# Altium schematic sheet MCU152A_Connectors.SchDoc
size 431 x 279 mm; Date: Not shown in title block; ApprovedBy: Not shown in title block; CheckedBy: Not shown in title block; Author: Not shown in title block; CompanyName: Not shown in title block; Engineer: Not shown in title block; Organization: Not shown in title block; Address1: Not shown in title block; Address2: Not shown in title block; Address3: Not shown in title block; Address4: Not shown in title block; DocumentNumber: 2; Revision: Use project parameter SCH_Rev; SheetNumber: 2; SheetTotal: 8; PageSetup: Record=PageOptions|CenterHorizontal=True|CenterVertical=True|PrintScale=1.00|XCorrection=1.00|YCorrection=1.00|PrintKind=0|BorderSize=5000000|LeftOffset=0|BottomOffset=0|Orientation=2|PaperLength=1000|PaperWidth=1000|Scale=100|PaperSource=15|PrintQuality=600|MediaType=1|DitherType=10|PaperKind=Letter|PrintScaleMode=1; CurrentTime: Not shown in title block; CurrentDate: Not shown in title block; Time: Not shown in title block; DocumentFullPathAndName: Not shown in title block; DocumentName: Not shown in title block; ModifiedDate: Not shown in title block; ImagePath: Not shown in title block
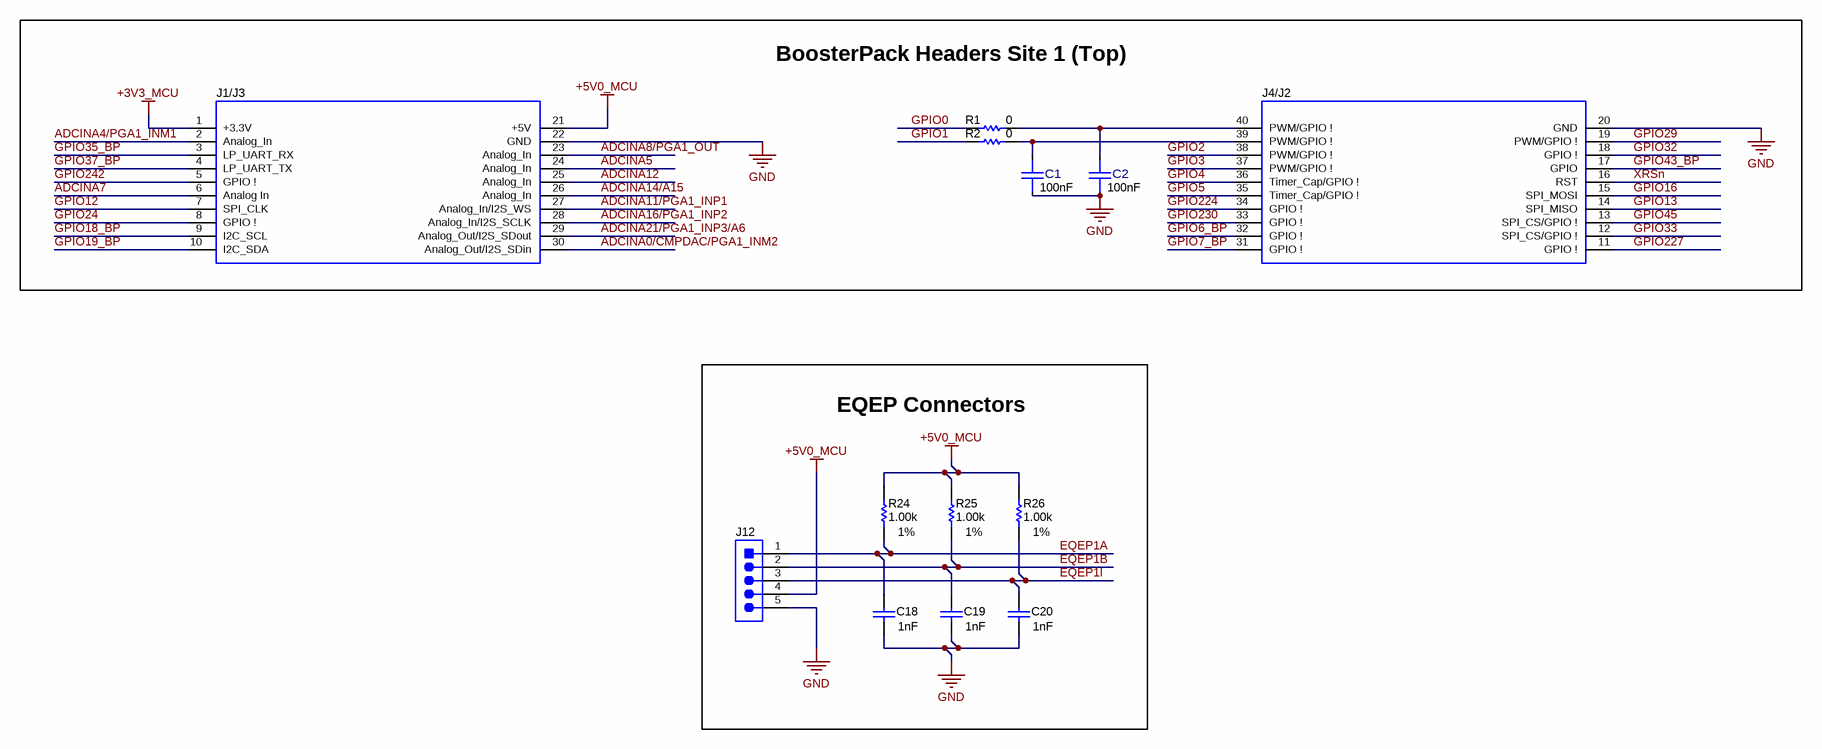
[diagram p0: MCU152A_Connectors.SchDoc]

## Parts
C1  Cap_F: 100nF  [FP-885012205018_0402-MFG]  (hidden comment: 885012205018)
C2  Cap_F: 100nF  [FP-885012205018_0402-MFG]  (hidden comment: 885012205018)
C18  Cap_F: 1nF  [0402]  (hidden comment: 885012205061)
C19  Cap_F: 1nF  [0402]  (hidden comment: 885012205061)
C20  Cap_F: 1nF  [0402]  (hidden comment: 885012205061)
J1/J3  SSQ-110-03-T-D  [BoosterPack_40pin_J1J3]  (value not drawn)
J4/J2  SSQ-110-03-T-D  [BoosterPack_40pin_J2J4]  (value not drawn)
J12  61300511121  [Wurth_61300511121]  (value not drawn)
R1  ValueDisplayed: 0  [0402]  (hidden comment: RC0402JR-070RL)
R2  ValueDisplayed: 0  [0402]  (hidden comment: RC0402JR-070RL)
R24  ValueDisplayed: 1.00k  Value1: 1%  [0402]  (hidden comment: CRCW04021K00FKED)
R25  ValueDisplayed: 1.00k  Value1: 1%  [0402]  (hidden comment: CRCW04021K00FKED)
R26  ValueDisplayed: 1.00k  Value1: 1%  [0402]  (hidden comment: CRCW04021K00FKED)

## Blocks framed on the sheet
BoosterPack Headers Site 1 (Top): C1 C2 J1/J3 J4/J2 R1 R2
EQEP Connectors: C18-C20 J12 R24-R26

## Nets
+3V3_MCU: J1/J3.1(+3.3V)
+5V0_MCU: J1/J3.21(+5V) J12.4 R24.2 R25.2 R26.2
GND: C1.1 C2.1 C18.2 C19.2 C20.2 J1/J3.22(GND) J4/J2.20(GND) J12.5
ADCINA0/CMPDAC/PGA1_INM2: J1/J3.30(Analog_Out/I2S_SDin)
ADCINA4/PGA1_INM1: J1/J3.2(Analog_In)
ADCINA5: J1/J3.24(Analog_In)
ADCINA7: J1/J3.6(Analog_In)
ADCINA8/PGA1_OUT: J1/J3.23(Analog_In)
ADCINA11/PGA1_INP1: J1/J3.27(Analog_In/I2S_WS)
ADCINA12: J1/J3.25(Analog_In)
ADCINA14/A15: J1/J3.26(Analog_In)
ADCINA16/PGA1_INP2: J1/J3.28(Analog_In/I2S_SCLK)
ADCINA21/PGA1_INP3/A6: J1/J3.29(Analog_Out/I2S_SDout)
EQEP1A: C18.1 J12.1 R24.1
EQEP1B: C19.1 J12.2 R25.1
EQEP1I: C20.1 J12.3 R26.1
GPIO0: R1.1
GPIO1: R2.1
GPIO2: J4/J2.38(PWM/GPIO_!)
GPIO3: J4/J2.37(PWM/GPIO_!)
GPIO4: J4/J2.36(Timer_Cap/GPIO_!)
GPIO5: J4/J2.35(Timer_Cap/GPIO_!)
GPIO6_BP: J4/J2.32(GPIO_!)
GPIO7_BP: J4/J2.31(GPIO_!)
GPIO12: J1/J3.7(SPI_CLK)
GPIO13: J4/J2.14(SPI_MISO)
GPIO16: J4/J2.15(SPI_MOSI)
GPIO18_BP: J1/J3.9(I2C_SCL)
GPIO19_BP: J1/J3.10(I2C_SDA)
GPIO24: J1/J3.8(GPIO_!)
GPIO29: J4/J2.19(PWM/GPIO_!)
GPIO32: J4/J2.18(GPIO_!)
GPIO33: J4/J2.12(SPI_CS/GPIO_!)
GPIO35_BP: J1/J3.3(LP_UART_RX)
GPIO37_BP: J1/J3.4(LP_UART_TX)
GPIO43_BP: J4/J2.17(GPIO)
GPIO45: J4/J2.13(SPI_CS/GPIO_!)
GPIO224: J4/J2.34(GPIO_!)
GPIO227: J4/J2.11(GPIO_!)
GPIO230: J4/J2.33(GPIO_!)
GPIO242: J1/J3.5(GPIO_!)
XRSn: J4/J2.16(RST)
NetC1_2: C1.2 J4/J2.39(PWM/GPIO_!) R2.2
NetC2_2: C2.2 J4/J2.40(PWM/GPIO_!) R1.2

## Notes on the sheet
- Drawn By:
- SVN Rev:
- Number:
- TID #:
- Orderable:
- Rev:
- Sheet Title:
- File:
- Project Title:
- Designed for:
- Assembly Variant:
- Mod. Date:
- Sheet:
- Size:
- of
- B
- http://www.ti.com
- Texas Instruments and/or its licensors do not warrant the accuracy or completeness of this specification or any information contained therein. Texas Instruments and/or its licensors do not warrant that this design will meet the specifications, will be suitable for your application or fit for any particular purpose, or will operate in an implementation. Texas Instruments and/or its licensors do not warrant that the design is production worthy. You should completely validate and test your design implementation to confirm the system functionality for your application.
- Engineer:
- Contact:
- © Texas Instruments

## Library data of the parts
C1 C2 = CMP-0090362-1: 0.1µF ±10% 10V Ceramic Capacitor X7R 0402 (1005 Metric); Manufacturer: Wurth Electronics; AEC Qualified: No; Value: 100nF; SizeZ_mm: 0.55mm; ValueDisplayed: 100000pF; TempCo: 15%; RoHS: TRUE; Tolerance_%: 10%; datasheet: https://www.we-online.com/catalog/datasheet/885012205018.pdf; Lead Free: Yes; Operating Temperature Range: -55°C to +125°C; ComponentLink1Description: Datasheet; Digikey Description: CAP CER 0.1UF 10V X7R 0402; Supplier Part Number 1: 732-7513-1-ND; Supplier 2: Mouser; Mouser Part Number: 710-885012205018; Digikey Part Number: 732-7513-1-ND; Temperature Characteristic: X7R; Supplier 1: Digikey; Datasheet Path: datasheets/Cap-885012205018.pdf; ComponentLink1URL: https://www.we-online.com/catalog/datasheet/885012205018.pdf; VDC_V: 10V; Supplier Part Number 2: 710-885012205018; PackageReference: 0402; PartNumber: 885012205018; Part Number: 885012205018; helpURL: https://upverter.com/upn/revision/1acbe355db19639d/
C18-C20 = CMP-0006231-2: CAP, CERM, 1000 pF, 50 V, +/- 10%, X7R, 0402; Manufacturer: Wurth Elektronik; Polarized: N; Value: 1000pF; U/M: EA; Value1: Unknown; VDC_V: 50V; TaMin_C: -55°C; TaMax_C: 125°C; SizeArea_mm2: 0.5; SizeAreaWB_mm2: 3; SizeX_mm: 1; SizeZ_mm: 0.6; AEC Category: Q200; CompType: Capacitor; PartNumber: 885012205061; ValueDisplayed: 1000pF; PackageReference: 0402; RoHS: Y; Tolerance_%: 10%; Value2: 50V; MountType: SMT; Technology: Ceramic; TempCo: X7R; Cap_Case: 0402; SizeY_mm: 0.5; Published: 2008-06-19; Publisher: Texas Instruments; LatestRevisionDate: 2017-03-09; ComponentLink1Description: Datasheet link; ComponentLink1URL: http://katalog.we-online.de/pbs/datasheet/885012205061.pdf; Supplier 1: Digi-Key; Supplier Part Number 1: 732-7556-1-ND; Supplier 2: Mouser; Supplier Part Number 2: 710-885012205061; AEC Qualified: N; AEC Grade: N/A
J1/J3 = CMP-0003837-4: Receptacle, 2.54mm, 10x2, Tin, TH; Alternate PartNumber: CRD-081413-A-G; Manufacturer: Samtec; Alternate Manufacturer: Major League Electronics; Note: Booster Pack 40 pin J1 and J3; Green_Lifecycle: Active; Green_REACh: Incomplete; Supplier 1: Digi-Key; CompType: Receptacle; PackageReference: 10x2 Receptacle; RoHS: Y; Supplier Part Number 1: SAM1204-10-ND; MountType: TH; PartNumber: SSQ-110-03-T-D; ComponentLink1Description: Datasheet Link; ComponentLink1URL: https://www.samtec.com/ftppub/cpdf/SSQ-1XX-XX-XXX-X-XX-XXX-XX-X-MKT.pdf; Supplier 2: Newark; Supplier Part Number 2: 11P8392; Green_EU RoHS: Passed; Green_EU RoHS-2: Passed
J4/J2 = CMP-0078266-4: Receptacle, 2.54mm, 10x2, Tin, TH; Alternate PartNumber: CRD-081413-A-G; Manufacturer: Samtec; Alternate Manufacturer: Major League Electronics; Note: Booster Pack 40 pin J2 and J4; Green_REACh: Incomplete; Green_Lifecycle: Active; Green_EU RoHS-2: Passed; CompType: Receptacle; Supplier 1: Digi-Key; PackageReference: 10x2 Receptacle; RoHS: Y; Supplier Part Number 1: SAM1204-10-ND; PartNumber: SSQ-110-03-T-D; MountType: TH; ComponentLink1Description: Datasheet Link; Green_EU RoHS: Passed; ComponentLink1URL: https://www.samtec.com/ftppub/cpdf/SSQ-1XX-XX-XXX-X-XX-XXX-XX-X-MKT.pdf; Supplier 2: Newark; Supplier Part Number 2: 11P8392
J12 = CMP-0084909-1: Header, 2.54mm, 5x1, Gold, TH; Manufacturer: Wurth Elektronik; Pitch_mm: 2.54; Gender: Male; Row_Count: 1; Shrouded: N; Current_A: 3A; Voltage_V: 250V; Color: Black; PinCount: 5; ContactFinish: Gold; ComponentLink1URL: https://katalog.we-online.de/em/datasheet/6130xx11121.pdf; ComponentLink1Description: Datasheet URL; CompType: Header; MountType: TH; PartNumber: 61300511121; RoHS: Y; PackageReference: Header, 2.54mm, 5x1, TH; ClassName: Header; Orientation: Vertical
R1 R2 = CMP-0027004-2: RES, 0, 5%, 0.063 W, 0402; Manufacturer: Yageo America; Power_W: 63mW; TempCo: 200 ppm/C; Value_Code: 0000; U/M: EA; Value: 0; EIA_Code: E24; SizeX_mm: 1; SizeY_mm: 0.5; SizeZ_mm: 0.6; Value2: 0.063W; VDC_V: 50V; AEC Category: Q200; Supplier Part Number 2: 603-RC0402JR-070RL; Publisher: Texas Instruments; Supplier 2: Mouser; Supplier Part Number 3: 9232516; Supplier 3: Farnell; Published: 2008-06-26; RoHS: Y; Value1: 5%; MountType: SMT; Supplier 1: Digi-Key; PackageReference: 0402; Tolerance_%: 5%; Res_ohm: 0; SizeArea_mm2: 0.5; CompType: Resistor; LatestRevisionDate: 2017-03-09; PartNumber: RC0402JR-070RL; AEC Qualified: ?; ComponentLink1Description: Datasheet link; Supplier Part Number 1: 311-0.0JRCT-ND; Technology: Thick Film; ComponentLink1URL: http://www.yageo.com/pdf/Pu-RC0402_51_PbFree_L_2.pdf
R24-R26 = CMP-0026071-3: RES, 1.00 k, 1%, 0.063 W, AEC-Q200 Grade 0, 0402; Manufacturer: Vishay-Dale; Value: 1.00k; Res_ohm: 1k; Value_Code: 1k00; Power_W: 63mW; Value2: 0.063W; VDC_V: 50V; TempCo: 100 ppm/C; SizeArea_mm2: 0.5; SizeX_mm: 1; SizeZ_mm: 0.6; EIA_Code: E96; AEC Category: Q200; AEC Qualified: Y; AEC Grade: 0; CompType: Resistor; PartNumber: CRCW04021K00FKED; PackageReference: 0402; RoHS: E; Tolerance_%: 1%; MountType: SMT; Technology: Thick Film; SizeY_mm: 0.5; ComponentLink1Description: Datasheet link; ComponentLink1URL: http://www.vishay.com/docs/20035/dcrcwe3.pdf; Supplier 1: Digi-Key; Supplier Part Number 1: 541-1.00KLCT-ND; Supplier 2: Newark; Supplier Part Number 2: 52K6545; Supplier 3: Mouser; Supplier Part Number 3: 71-CRCW0402-1.0K-E3